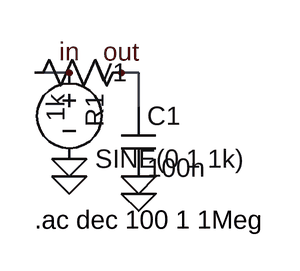
[diagram p0: schematic sim_1780311389_d3056606.asc]
sim_1780311389_d3056606.asc, the LTspice schematic file:
Version 4
SHEET 1 880 680
WIRE 64 64 32 64
WIRE 112 64 128 64
WIRE 128 64 128 96
FLAG 64 160 0
FLAG 128 176 0
FLAG 64 144 0
FLAG 128 160 0
FLAG 64 64 in
FLAG 112 64 out
SYMBOL voltage 64 48 R0
SYMATTR InstName V1
SYMATTR Value SINE(0 1 1k)
SYMATTR Value2 AC 1
SYMBOL res 128 48 R90
SYMATTR InstName R1
SYMATTR Value 1k
SYMBOL cap 112 96 R0
SYMATTR InstName C1
SYMATTR Value 100n
TEXT 32 200 Left 2 !.ac dec 100 1 1Meg

The netlist it stands for:
* sim_1780311389_d3056606.asc
V1 in 0 SINE(0 1 1k) AC 1
R1 out in 1k
C1 out 0 100n
.ac dec 100 1 1Meg
.backanno
.end